# EAGLE schematic band_pass_filter (EAGLE 9.6.1)
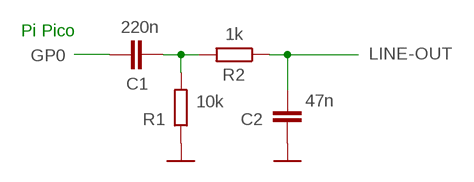
[diagram p0: schematic, sheet 1]

## Parts
C1  220n  C  [C0805]
C2  47n  C  [C0805]
R1  10k  R  [R0805]
R2  1k  R  [R0805]

## Nets
GND: C2.1 R1.1
GP0: C1.1
LINE-OUT: C2.2 R2.1
N$1: C1.2 R1.2 R2.2

## Notes on the sheet
- Pi Pico

## Library data of the parts
C1 C2 = eagle-ltspice:C: CAPACITOR, European symbol; SPICEMODEL: NONE; SPICEPREFIX: C
R1 R2 = eagle-ltspice:R: RESISTOR, European symbol; SPICEMODEL: NONE; SPICEPREFIX: R